# Altium schematic sheet S10B-M-V2.0.SchDoc
size A3
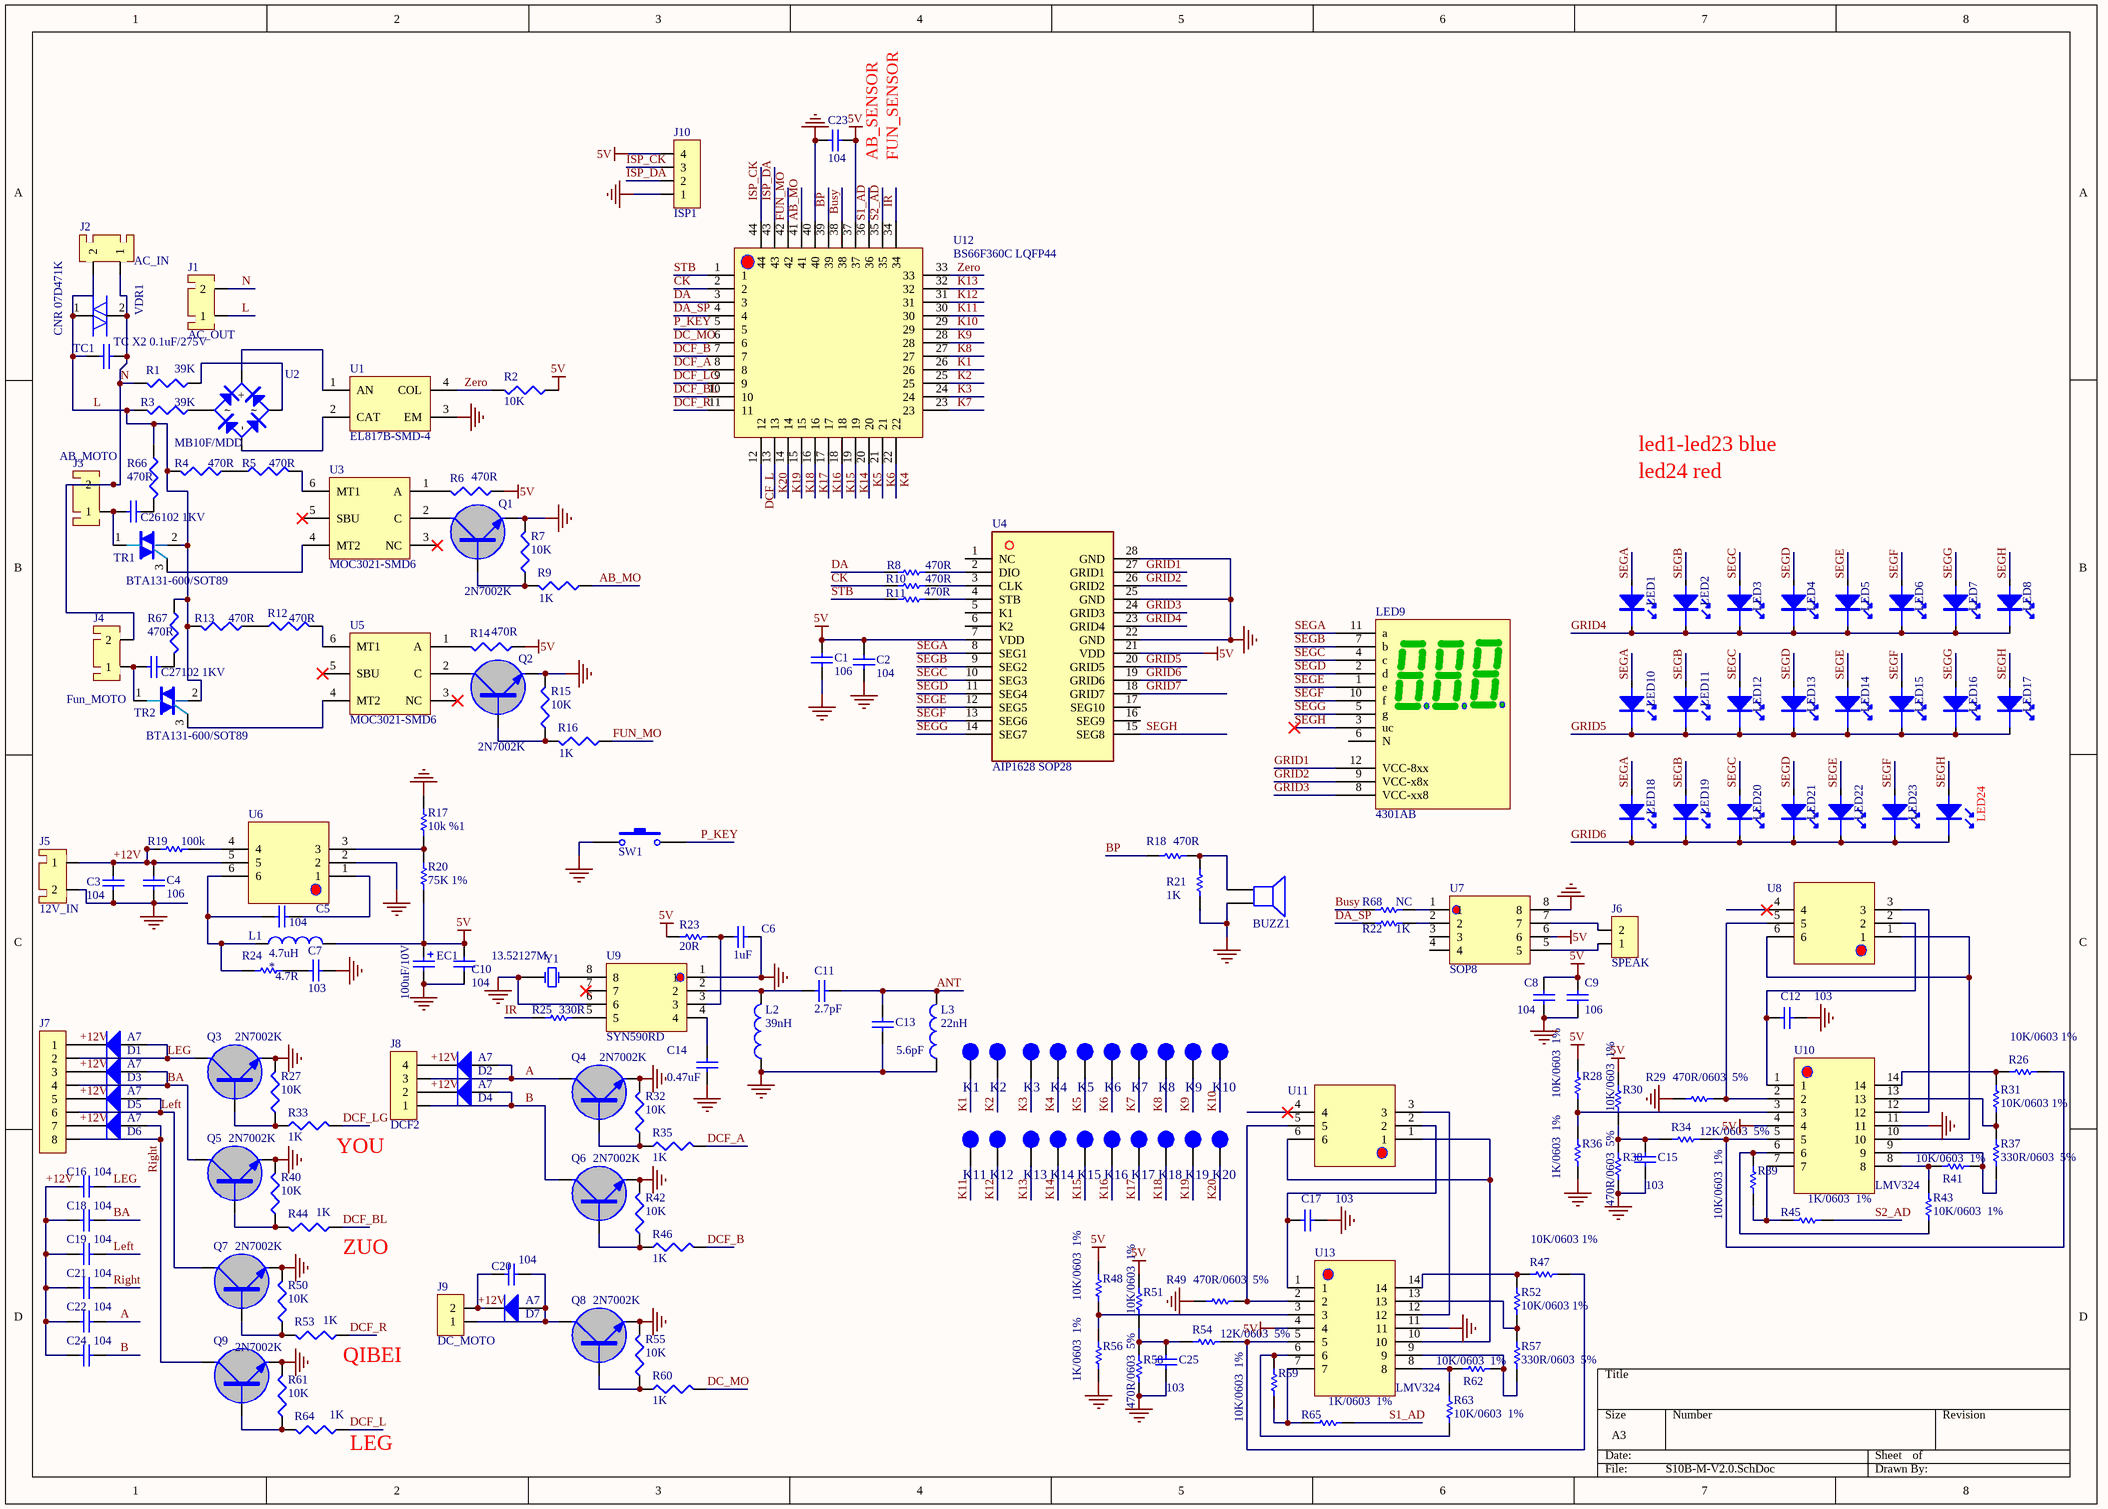
[diagram p0: S10B-M-V2.0.SchDoc]

## Parts
BUZZ1  Speaker  [BUZ-1407-7.5]  (value not drawn)
C1  106  [0805C]
C2  104  [0603C]
C3  104  [0603C]
C4  106  [0805C]
C5  104  [0603C]
C6  1uF  [0603C]
C7  103  [0603C]
C8  104  [0603C]
C9  106  [0805C]
C10  104  [0603C]
C11  2.7pF  [0603C]
C12  103  [0603C]
C13  5.6pF  [0603C]
C14  0.47uF  [0603C]
C15  103  [0603C]
C16  104  [0603C]
C17  103  [0603C]
C18  104  [0603C]
C19  104  [0603C]
C20  104  [0603C]
C21  104  [0603C]
C22  104  [0603C]
C23  104  [0603C]
C24  104  [0603C]
C25  103  [0603C]
C26  102 1KV  [1206C]
C27  102 1KV  [1206C]
D1  A7  [SOD-123FL_L2.8-W1.8-LS3.7]
D2  A7  [SOD-123FL_L2.8-W1.8-LS3.7]
D3  A7  [SOD-123FL_L2.8-W1.8-LS3.7]
D4  A7  [SOD-123FL_L2.8-W1.8-LS3.7]
D5  A7  [SOD-123FL_L2.8-W1.8-LS3.7]
D6  A7  [SOD-123FL_L2.8-W1.8-LS3.7]
D7  A7  [SOD-123FL_L2.8-W1.8-LS3.7]
EC1  100uF/10V  [CAP SMD 6.3*5.5mm]
J1  AC_OUT  [K-VH3.96-3P]
J2  AC_IN  [K-VH3.96-3P]
J3  AB_MOTO  [K-VH3.96-3P]
J4  Fun_MOTO  [K-VH3.96-3P]
J5  12V_IN  [CON2-SMD-XHB 2*2.5MM]
J6  SPEAK  [CON2-SMD_PH2.0-1X2PW]
J7  (no value)  [CON8-SMD-XHB 8*2.5MM]
J8  DCF2  [CON4-SMD_4P-P2.54_XH2.54-4AB]
J9  DC_MOTO  [CON2-SMD-XHB 2*2.5MM]
J10  ISP1  [CON4 -2.54-H]
K1  Φ15 H8mm弹簧  [TK_HF-13*13*8]  (value not drawn)
K2  Φ15 H8mm弹簧  [TK_HF-13*13*8]  (value not drawn)
K3  Φ15 H8mm弹簧  [TK_HF-13*13*8]  (value not drawn)
K4  Φ15 H8mm弹簧  [TK_HF-13*13*8]  (value not drawn)
K5  Φ15 H8mm弹簧  [TK_HF-13*13*8]  (value not drawn)
K6  Φ15 H8mm弹簧  [TK_HF-13*13*8]  (value not drawn)
K7  Φ15 H8mm弹簧  [TK_HF-13*13*8]  (value not drawn)
K8  Φ15 H8mm弹簧  [TK_HF-13*13*8]  (value not drawn)
K9  Φ15 H8mm弹簧  [TK_HF-13*13*8]  (value not drawn)
K10  Φ15 H8mm弹簧  [TK_HF-13*13*8]  (value not drawn)
K11  Φ15 H8mm弹簧  [TK_HF-13*13*8]  (value not drawn)
K12  Φ15 H8mm弹簧  [TK_HF-13*13*8]  (value not drawn)
K13  Φ15 H8mm弹簧  [TK_HF-13*13*8]  (value not drawn)
K14  Φ15 H8mm弹簧  [TK_HF-13*13*8]  (value not drawn)
K15  Φ15 H8mm弹簧  [TK_HF-13*13*8]  (value not drawn)
K16  Φ15 H8mm弹簧  [TK_HF-13*13*8]  (value not drawn)
K17  Φ15 H8mm弹簧  [TK_HF-13*13*8]  (value not drawn)
K18  Φ15 H8mm弹簧  [TK_HF-13*13*8]  (value not drawn)
K19  Φ15 H8mm弹簧  [TK_HF-13*13*8]  (value not drawn)
K20  Φ15 H8mm弹簧  [TK_HF-13*13*8]  (value not drawn)
L1  4.7uH  [INDC5050]
L2  39nH  [0603R]
L3  22nH  [0603R]
LED1  LED_0603  [LED_0603]  (value not drawn)
LED2  LED_0603  [LED_0603]  (value not drawn)
LED3  LED_0603  [LED_0603]  (value not drawn)
LED4  LED_0603  [LED_0603]  (value not drawn)
LED5  LED_0603  [LED_0603]  (value not drawn)
LED6  LED_0603  [LED_0603]  (value not drawn)
LED7  LED_0603  [LED_0603]  (value not drawn)
LED8  LED_0603  [LED_0603]  (value not drawn)
LED9  4301AB  [LED4031-SEG-TH_12P-L30.1-W16.0-P2.54-S12.70-BL]
LED10  LED_0603  [LED_0603]  (value not drawn)
LED11  LED_0603  [LED_0603]  (value not drawn)
LED12  LED_0603  [LED_0603]  (value not drawn)
LED13  LED_0603  [LED_0603]  (value not drawn)
LED14  LED_0603  [LED_0603]  (value not drawn)
LED15  LED_0603  [LED_0603]  (value not drawn)
LED16  LED_0603  [LED_0603]  (value not drawn)
LED17  LED_0603  [LED_0603]  (value not drawn)
LED18  LED_0603  [LED_0603]  (value not drawn)
LED19  LED_0603  [LED_0603]  (value not drawn)
LED20  LED_0603  [LED_0603]  (value not drawn)
LED21  LED_0603  [LED_0603]  (value not drawn)
LED22  LED_0603  [LED_0603]  (value not drawn)
LED23  LED_0603  [LED_0603]  (value not drawn)
LED24  LED_0603  [LED_0603]  (value not drawn)
Q1  2N7002K  [SOT-23 - MOS]
Q2  2N7002K  [SOT-23 - MOS]
Q3  2N7002K  [SOT-23 - MOS]
Q4  2N7002K  [SOT-23 - MOS]
Q5  2N7002K  [SOT-23 - MOS]
Q6  2N7002K  [SOT-23 - MOS]
Q7  2N7002K  [SOT-23 - MOS]
Q8  2N7002K  [SOT-23 - MOS]
Q9  2N7002K  [SOT-23 - MOS]
R1  39K  [1206R]
R2  10K  [0603]
R3  39K  [1206R]
R4  470R  [1206R]
R5  470R  [1206R]
R6  470R  [0603]
R7  10K  [0603]
R8  470R  [0603R]
R9  1K  [0603]
R10  470R  [0603R]
R11  470R  [0603R]
R12  470R  [1206R]
R13  470R  [1206R]
R14  470R  [0603]
R15  10K  [0603]
R16  1K  [0603]
R17  10k %1  [0603R]
R18  470R  [0603R]
R19  100k  [0603R]
R20  75K 1%  [0603R]
R21  1K  [0603R]
R22  1K  [0603R]
R23  20R  [0603R]
R24  4.7R  [0603R]
R25  330R  [0603R]
R26  10K/0603 1%  [0603R]
R27  10K  [0603]
R28  10K/0603  1%  [0603R]
R29  470R/0603  5%  [0603R]
R30  10K/0603  1%  [0603R]
R31  10K/0603 1%  [0603R]
R32  10K  [0603]
R33  1K  [0603]
R34  12K/0603  5%  [0603R]
R35  1K  [0603]
R36  1K/0603  1%  [0603R]
R37  330R/0603  5%  [0603R]
R38  470R/0603  5%  [0603R]
R39  10K/0603  1%  [0603R]
R40  10K  [0603]
R41  10K/0603  1%  [0603R]
R42  10K  [0603]
R43  10K/0603  1%  [0603R]
R44  1K  [0603]
R45  1K/0603  1%  [0603R]
R46  1K  [0603]
R47  10K/0603 1%  [0603R]
R48  10K/0603  1%  [0603R]
R49  470R/0603  5%  [0603R]
R50  10K  [0603]
R51  10K/0603  1%  [0603R]
R52  10K/0603 1%  [0603R]
R53  1K  [0603]
R54  12K/0603  5%  [0603R]
R55  10K  [0603]
R56  1K/0603  1%  [0603R]
R57  330R/0603  5%  [0603R]
R58  470R/0603  5%  [0603R]
R59  10K/0603  1%  [0603R]
R60  1K  [0603]
R61  10K  [0603]
R62  10K/0603  1%  [0603R]
R63  10K/0603  1%  [0603R]
R64  1K  [0603]
R65  1K/0603  1%  [0603R]
R66  470R  [1206R]
R67  470R  [1206R]
R68  NC  [0603R]
SW1  SW-PB  [BUTTON-SMD-6*6*10]  (value not drawn)
TC1  TC X2 0.1uF/275V  [CAP-TH_L13.0-W6.0-P10.00-D0.6]
TR1  BTA131-600/SOT89  [SOT-89 BT131-600]
TR2  BTA131-600/SOT89  [SOT-89 BT131-600]
U1  EL817B-SMD-4  [PC817-smd]
U2  MB10F/MDD  [DB-MB10F]
U3  MOC3021-SMD6  [SMD6]
U4  AIP1628 SOP28  [SOP28(300MIL)]
U5  MOC3021-SMD6  [SMD6]
U6  HT7712  [SOT23-6_M]  (value not drawn)
U7  SOP8  [SOP8-SS]
U8  SOP6  [PSG010R/S]  (value not drawn)
U9  SYN590RD  [SOP8(5.1*6.2mm)]
U10  LMV324  [SOP14(150mil)]
U11  SOP6  [PSG010R/S]  (value not drawn)
U12  BS66F360C LQFP44  [LQFP44]
U13  LMV324  [SOP14(150mil)]
VDR1  CNR 07D471K  [RES-TH_L9.0-W5.0-P5-D0.7-S3.00]
Y1  13.52127M  [HC-49S_L11.4-W4.8]

## Nets
5V: C1.2 C2.2 C8.1 C9.1 C10.1 C23.1 EC1.1 J10.4 L1.2 R2.1 R6.1 R14.1 R20.1 R23.1 R28.1 R30.1 R48.1 R51.1 U4.7(VDD) U4.21(VDD) U7.6 U10.4 U12.37 U13.4
GND: BUZZ1.1 C1.1 C2.1 C3.2 C4.2 C6.2 C7.1 C8.2 C9.2 C10.2 C12.1 C13.1 C14.2 C15.1 C17.1 C23.2 C25.1 EC1.2 J5.2 J10.1 L2.1 L3.1 Q1.E Q2.E Q3.E Q4.E Q5.E Q6.E Q7.E Q8.E Q9.E R7.2 R15.2 R17.2 R21.2 R27.2 R29.2 R32.2 R36.2 R38.2 R40.2 R42.2 R49.2 R50.2 R55.2 R56.2 R58.2 R61.2 SW1.1 U1.3(EM) U4.22(GND) U4.25(GND) U4.28(GND) U6.2 U7.8 U9.1 U9.6 U10.11 U12.40 U13.11 Y1.2(OSC2)
+12V: C3.1 C4.1 C16.1 C18.1 C19.1 C20.1 C21.1 C22.1 C24.1 D1.2(K) D2.2(K) D3.2(K) D4.2(K) D5.2(K) D6.2(K) D7.2(K) J5.1 J7.1 J7.3 J7.5 J7.7 J8.2 J8.4 J9.2 R19.1 U6.5
A: C22.2 D2.1(A) J8.3 Q4.C
AB_MO: R9.1 U12.41
ANT: C11.1 C13.2 L3.2
B: C24.2 D4.1(A) J8.1 Q6.C
BA: C18.2 D3.1(A) J7.4 Q5.C
BP: R18.2 U12.39
Busy: R68.1 U12.38
CK: R10.1 U12.2
DA: R8.1 U12.3
DA_SP: R22.1 U12.4
DC_MO: R60.2 U12.6
DCF_A: R35.2 U12.8
DCF_B: R46.2 U12.7
DCF_BL: R44.1 U12.10
DCF_L: R64.1 U12.12
DCF_LG: R33.2 U12.9
DCF_R: R53.1 U12.11
FUN_MO: R16.1 U12.42
GRID1: LED9.12(VCC-8xx) U4.27(GRID1)
GRID2: LED9.9(VCC-x8x) U4.26(GRID2)
GRID3: LED9.8(VCC-xx8) U4.24(GRID3)
GRID4: LED1.2 LED2.2 LED3.2 LED4.2 LED5.2 LED6.2 LED7.2 LED8.2 U4.23(GRID4)
GRID5: LED10.2 LED11.2 LED12.2 LED13.2 LED14.2 LED15.2 LED16.2 LED17.2 U4.20(GRID5)
GRID6: LED18.2 LED19.2 LED20.2 LED21.2 LED22.2 LED23.2 LED24.2 U4.19(GRID6)
GRID7: U4.18(GRID7)
IR: R25.1 U12.34
ISP_CK: J10.3 U12.44
ISP_DA: J10.2 U12.43
K1: K1.2 U12.26
K2: K2.2 U12.25
K3: K3.2 U12.24
K4: K4.2 U12.22
K5: K5.2 U12.20
K6: K6.2 U12.21
K7: K7.2 U12.23
K8: K8.2 U12.27
K9: K9.2 U12.28
K10: K10.2 U12.29
K11: K11.2 U12.30
K12: K12.2 U12.31
K13: K13.2 U12.32
K14: K14.2 U12.19
K15: K15.2 U12.18
K16: K16.2 U12.17
K17: K17.2 U12.16
K18: K18.2 U12.15
K19: K19.2 U12.14
K20: K20.2 U12.13
L: J1.1 J2.2 R3.2 R4.2 R13.2 R66.1 R67.1 TC1.2 TR1.2 TR2.2 VDR1.1
Left: C19.2 D5.1(A) J7.6 Q7.C
LEG: C16.2 D1.1(A) J7.2 Q3.C
N: J1.2 J2.1 J3.2 J4.2 R1.2 TC1.1 VDR1.2
P_KEY: SW1.2 U12.5
Right: C21.2 D6.1(A) J7.8 Q9.C
S1_AD: R65.1 U12.36
S2_AD: R45.1 U12.35
SEGA: LED1.1 LED9.11(a) LED10.1 LED18.1 U4.8(SEG1)
SEGB: LED2.1 LED9.7(b) LED11.1 LED19.1 U4.9(SEG2)
SEGC: LED3.1 LED9.4(c) LED12.1 LED20.1 U4.10(SEG3)
SEGD: LED4.1 LED9.2(d) LED13.1 LED21.1 U4.11(SEG4)
SEGE: LED5.1 LED9.1(e) LED14.1 LED22.1 U4.12(SEG5)
SEGF: LED6.1 LED9.10(f) LED15.1 LED23.1 U4.13(SEG6)
SEGG: LED7.1 LED9.5(g) LED16.1 U4.14(SEG7)
SEGH: LED8.1 LED9.3(uc) LED17.1 LED24.1 U4.15(SEG8)
STB: R11.1 U12.1
Zero: R2.2 U1.4(COL) U12.33
NetBUZZ1_2: BUZZ1.2 R18.1 R21.1
NetC5_1: C5.1 U6.1
NetC5_2: C5.2 L1.1 R24.2 U6.6
NetC6_1: C6.1 R23.2 U9.3
NetC7_2: C7.2 R24.1
NetC11_2: C11.2 L2.2 U9.2
NetC12_2: C12.2 U8.2 U10.1
NetC14_1: C14.1 U9.4
NetC15_2: C15.2 R30.2 R34.2 R38.1
NetC17_2: C17.2 U11.2 U13.1
NetC20_2: C20.2 D7.1(A) J9.1 Q8.C
NetC25_2: C25.2 R51.2 R54.2 R58.1
NetC26_1: C26.1 R66.2
NetC26_2: C26.2 J3.1 TR1.1
NetC27_1: C27.1 R67.2
NetC27_2: C27.2 J4.1 TR2.1
NetJ6_1: J6.1 U7.5
NetJ6_2: J6.2 U7.7
NetQ1_B: Q1.B R7.1 R9.2
NetQ1_C: Q1.C U3.2(C)
NetQ2_B: Q2.B R15.1 R16.2
NetQ2_C: Q2.C U5.2(C)
NetQ3_B: Q3.B R27.1 R33.1
NetQ4_B: Q4.B R32.1 R35.1
NetQ5_B: Q5.B R40.1 R44.2
NetQ6_B: Q6.B R42.1 R46.1
NetQ7_B: Q7.B R50.1 R53.2
NetQ8_B: Q8.B R55.1 R60.1
NetQ9_B: Q9.B R61.1 R64.2
NetR1_1: R1.1 U2.AC2(～)
NetR3_1: R3.1 U2.AC1(～)
NetR4_1: R4.1 R5.1
NetR5_2: R5.2 U3.6(MT1)
NetR6_2: R6.2 U3.1(A)
NetR8_2: R8.2 U4.2(DIO)
NetR10_2: R10.2 U4.3(CLK)
NetR11_2: R11.2 U4.4(STB)
NetR12_1: R12.1 R13.1
NetR12_2: R12.2 U5.6(MT1)
NetR14_2: R14.2 U5.1(A)
NetR17_1: R17.1 R20.2 U6.3
NetR19_2: R19.2 U6.4
NetR22_2: R22.2 U7.2
NetR25_2: R25.2 U9.5
NetR26_1: R26.1 R31.1 U10.14
NetR26_2: R26.2 R34.1 U10.5
NetR28_2: R28.2 R36.1 U10.3
NetR29_1: R29.1 U8.5 U10.2
NetR31_2: R31.2 R37.1 U10.13
NetR37_2: R37.2 R41.2 U10.9
NetR39_1: R39.1 R43.2 U10.6
NetR39_2: R39.2 R45.2 U10.7
NetR41_1: R41.1 R43.1 U10.8
NetR47_1: R47.1 R52.1 U13.14
NetR47_2: R47.2 R54.1 U13.5
NetR48_2: R48.2 R56.1 U13.3
NetR49_1: R49.1 U11.5 U13.2
NetR52_2: R52.2 R57.1 U13.13
NetR57_2: R57.2 R62.2 U13.9
NetR59_1: R59.1 R63.2 U13.6
NetR59_2: R59.2 R65.2 U13.7
NetR62_1: R62.1 R63.1 U13.8
NetR68_2: R68.2 U7.1
NetTR1_3: TR1.3 U3.4(MT2)
NetTR2_3: TR2.3 U5.4(MT2)
NetU1_1: U1.1(AN) U2.V+(+)
NetU1_2: U1.2(CAT) U2.V-(-)
NetU8_1: U8.1 U8.6 U10.10
NetU8_3: U8.3 U10.12
NetU9_8: U9.8 Y1.1(OSC1)
NetU11_1: U11.1 U11.6 U13.10
NetU11_3: U11.3 U13.12

Not connected (* = marked no-connect by the designer): LED9 6(N); U3 3(NC)* 5(SBU)*; U4 1(NC) 5(K1) 6(K2) 16(SEG9) 17(SEG10); U5 3(NC)* 5(SBU)*; U7 3 4; U8 4*; U9 7*; U11 4*

## Notes on the sheet
- (near C23) AB_SENSOR
- (near C23) FUN_SENSOR
- led1-led23 blue
- led24 red
- (near R33) YOU
- (near R44) ZUO
- (near R53) QIBEI
- (near R64) LEG

## Library data of the parts
BUZZ1 = Speaker: Loudspeaker; Manufacturer: Generic Components; Published: 1999
C1 C2 C4 C5 C8-C10 C20 C26 C27 = Cap: Capacitor; Manufacturer: Generic Components; Class: Passive; Value: 100pF; Published: 08/06/2000; Publisher: Altium Hobart Technology Centre; SubClass: Capacitor
C3 C7 C12 C15-C19 C21-C25 = Cap: Capacitor; Value: 0; Published: 8-Jun-2000; LatestRevisionDate: 17-Jul-2002; LatestRevisionNote: Re-released for DXP Platform.; PackageReference: RAD-0.3; Publisher: Altium Limited; PackageDescription: Radial Cap, Thru-Hole; 2 Leads; 0.3 in Pin Spacing
C6 C11 C13 C14 = Cap: Capacitor; Value: 104; Published: 8-Jun-2000; LatestRevisionDate: 17-Jul-2002; LatestRevisionNote: Re-released for DXP Platform.; PackageReference: RAD-0.3; Publisher: Altium Limited; PackageDescription: Radial Cap, Thru-Hole; 2 Leads; 0.3 in Pin Spacing
D1-D7 = Diode 1N4007: 1 Amp General Purpose Rectifier; Published: 8-Jun-2000; LatestRevisionDate: 17-Jul-2002; LatestRevisionNote: Re-released for DXP Platform.; DatasheetVersion: 1998; PackageVersion: Aug-1999; PackageReference: DO-41; Publisher: Altium Limited; PackageDescription: Diode, Axial; Body 5.2 x 2.7 mm (LxDia. max), Lead Dia. 0.86 mm (max); Code_JEDEC: DO-204-AL; ComponentLink1Description: Manufacturer Link; ComponentLink1URL: http://www.fairchildsemi.com/; ComponentLink2Description: Datasheet; ComponentLink2URL: http://www.fairchildsemi.com/ds/1N%2F1N4001.pdf
EC1 = Cap Pol1: Polarized Capacitor (Radial); Manufacturer: Generic Components; Class: Passive; Value: 100pF; Published: 08/06/2000; Publisher: Altium Hobart Technology Centre; SubClass: Capacitor
J1-J4 = PITCH3.96-5.0-2A
J5 = PITCH2.5-2A
J6 J9 = CON2
J7 = CON8
J8 J10 = CON4
K1-K20 = TOUCH-PAD
L1-L3 = Inductor: Code_IEC: 1005; Published: 8-Jun-2000; LatestRevisionDate: 29-May-2009; LatestRevisionNote: IPC-7351 Footprint Added.; PackageReference: 0402-A; Publisher: Altium Limited; PackageDescription: Chip Inductor; Code_JEITA: 0402; Value: *
LED1-LED8 LED10-LED24 = LED
LED9 = LED-888-COM VCC-1
Q1-Q9 = NPN-8050-BCE-25V/500mA
R1 R3-R5 R12 R13 R66 R67 = 1Ω±1%/0805-1206
R2 R6 R7 R9 R14-R16 R27 R32 R33 R35 R40 R42 R44 R46 R50 R53 R55 R60 R61 R64 = 1Ω±1%/0603-0805
R8 R10 R11 R17-R26 R28-R31 R34 R36-R39 R41 R43 R45 R47-R49 R51 R52 R54 R56-R59 R62 R63 R65 R68 = Res1: Resistor; Value: 0; Published: 8-Jun-2000; LatestRevisionDate: 17-Jul-2002; LatestRevisionNote: Re-released for DXP Platform.; PackageReference: AXIAL-0.3; Publisher: Altium Limited; PackageDescription: Axial Device, Thru-Hole; 2 Leads; 0.3 in Pin Spacing
SW1 = SW-PB: Switch; Published: 24-Mar-1999; LatestRevisionDate: 17-Jul-2002; LatestRevisionNote: Re-released for DXP Platform.; PackageReference: SPST-2; Publisher: Altium Limited; PackageDescription: Switch; 2 Leads
TC1 = CAP1
TR1 TR2 = Triac
U1 = EL817-DIP-4
U2 = BD-ABS10/MB10S: Diode Bridge
U3 U5 = MOC3021-DIP-6
U4 = TM1628 SOP28: LED driver, SOP28; Manufacturer: Generic Components; Class: Connector
U6 = SOP6
U9 = SOP8
U10 U13 = SOP14
U12 = LQFP44: BS66F360C
VDR1 = VAR
Y1 = XTAL: Crystal Oscillator; Published: 8-Jun-2000; LatestRevisionDate: 17-Jul-2002; LatestRevisionNote: Re-released for DXP Platform.; PackageReference: R38; Publisher: Altium Limited; PackageDescription: Crystal, Thru-Hole; 2 Leads; Body 3.1 x 8.2 mm (Dia.xH)